# EAGLE design SpinCoaterV3-AU DC_Motor (EAGLE 7.4.0)
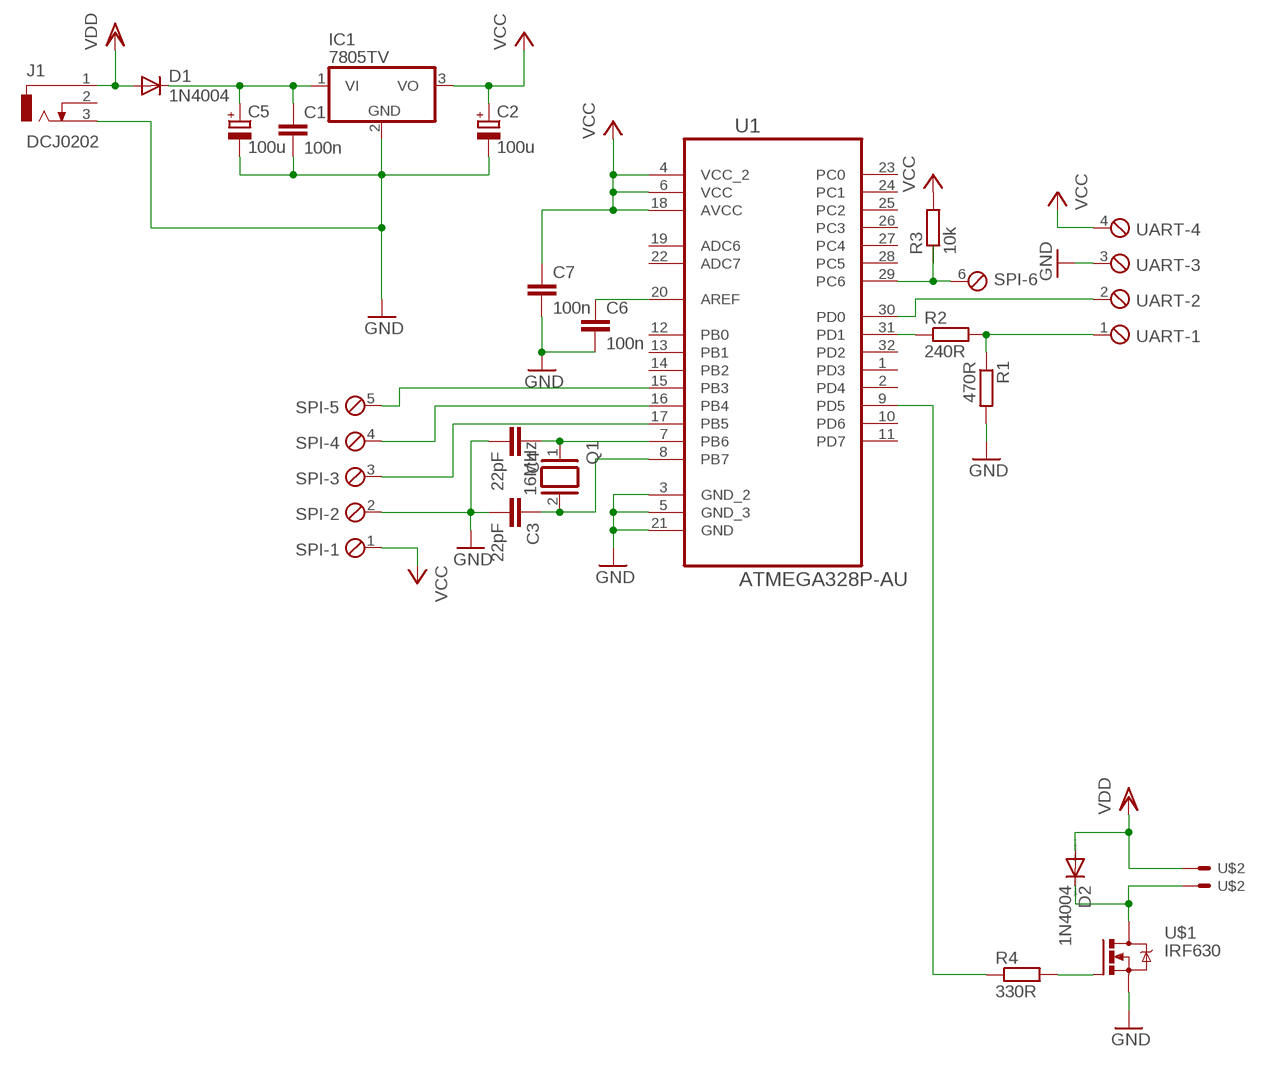
[diagram p0: schematic, sheet 1]

## Parts
C1  100n  C-EU075-032X103  [C075-032X103]
C2  100u  CPOL-EUE2.5-6  [E2,5-6]
C3  22pF  C-EU050-030X075  [C050-030X075]
C4  22pF  C-EU050-030X075  [C050-030X075]
C5  100u  CPOL-EUE2.5-6  [E2,5-6]
C6  100n  C-EU075-032X103  [C075-032X103]
C7  100n  C-EU075-032X103  [C075-032X103]
D1  1N4004  [DO41-10]
D2  1N4004  [DO41-10]
IC1  7805TV  [TO220V]
J1  DCJ0202  [DCJ0202]
Q1  16MHz  XTAL/S  [QS]
R1  470R  R-EU_0207/10  [0207/10]
R2  240R  R-EU_0207/10  [0207/10]
R3  10k  R-EU_0207/10  [0207/10]
R4  330R  R-EU_0207/10  [0207/10]
SPI  MPT6  [6POL254]
U1  ATMEGA328P-AU  [QFP80P900X900X120-32N]
U$1  IRF630  [TO-220BH]
U$2  CON-MOTORDC  [CON-MOTOR]
UART  MPT4  [4POL254]

## Nets
GND: C1.2 C2.- C3.2 C4.2 C5.- C6.2 C7.2 IC1.2(GND) J1.3 R1.2 SPI.2 U1.3(GND_2) U1.5(GND_3) U1.21(GND) U$1.S UART.3
N$1: R3.1 SPI.6 U1.29(PC6)
N$2: C4.1 Q1.1 U1.7(PB6)
N$3: C3.1 Q1.2 U1.8(PB7)
N$4: SPI.3 U1.17(PB5)
N$5: R2.1 U1.31(PD1)
N$6: SPI.4 U1.16(PB4)
N$7: SPI.5 U1.15(PB3)
N$8: R4.2 U$1.G
N$9: U1.30(PD0) UART.2
N$10: R1.1 R2.2 UART.1
N$11: R4.1 U1.9(PD5)
N$12: D2.C U$1.D U$2.P$2(S2)
N$13: C6.1 U1.20(AREF)
N$14: C1.1 C5.+ D1.C IC1.1(VI)
VCC: C2.+ C7.1 IC1.3(VO) R3.2 SPI.1 U1.4(VCC_2) U1.6(VCC) U1.18(AVCC) UART.4
VDD: D1.A D2.A J1.1 U$2.P$1(S1)
Unconnected: J1.2 U1.1(PD3) U1.2(PD4) U1.10(PD6) U1.11(PD7) U1.12(PB0) U1.13(PB1) U1.14(PB2) U1.19(ADC6) U1.22(ADC7) U1.23(PC0) U1.24(PC1) U1.25(PC2) U1.26(PC3) U1.27(PC4) U1.28(PC5) U1.32(PD2)

## Library data of the parts
C1 C3 C4 C6 C7 = rcl:C-EU: CAPACITOR, European symbol
C2 C5 = rcl:CPOL-EU: POLARIZED CAPACITOR, European symbol
D1 = diode-1:1N4004: DIODE general purpose rectifier, 1 A
D2 = diode:1N4004: DIODE general purpose rectifier, 1 A
IC1 = linear:78*: Positive VOLTAGE REGULATOR Source: http://cache.national.com/ds/LM/LM78L05.pdf http://www.fairchildsemi.com/ds/LM/LM7805.pdf
J1 = con-jack:DCJ0202: DC POWER JACK Source: DCJ0202.pdf; OC_FARNELL: unknown; OC_NEWARK: unknown
Q1 = special:XTAL/S: CRYSTAL
R1-R4 = rcl:R-EU_: RESISTOR, European symbol
SPI = con-phoenix-254:MPT6: PHOENIX CONNECTOR; OC_FARNELL: unknown; OC_NEWARK: unknown
U1 = Atmel_By_element14_Batch_1-00:ATMEGA328P-AU: 8-bit Microcontroller with In-System Programmable Flash; MPN: ATMEGA328P-AU; OC_FARNELL: 1715486; OC_NEWARK: 14R4631; PACKAGE: TQFP-32; SUPPLIER: Atmel
U$1 = OpenSpinCoaterComponent:IRF630
U$2 = OpenSpinCoaterComponent:CON-MOTORDC
UART = con-phoenix-254:MPT4: PHOENIX CONNECTOR; OC_FARNELL: unknown; OC_NEWARK: unknown

## Board
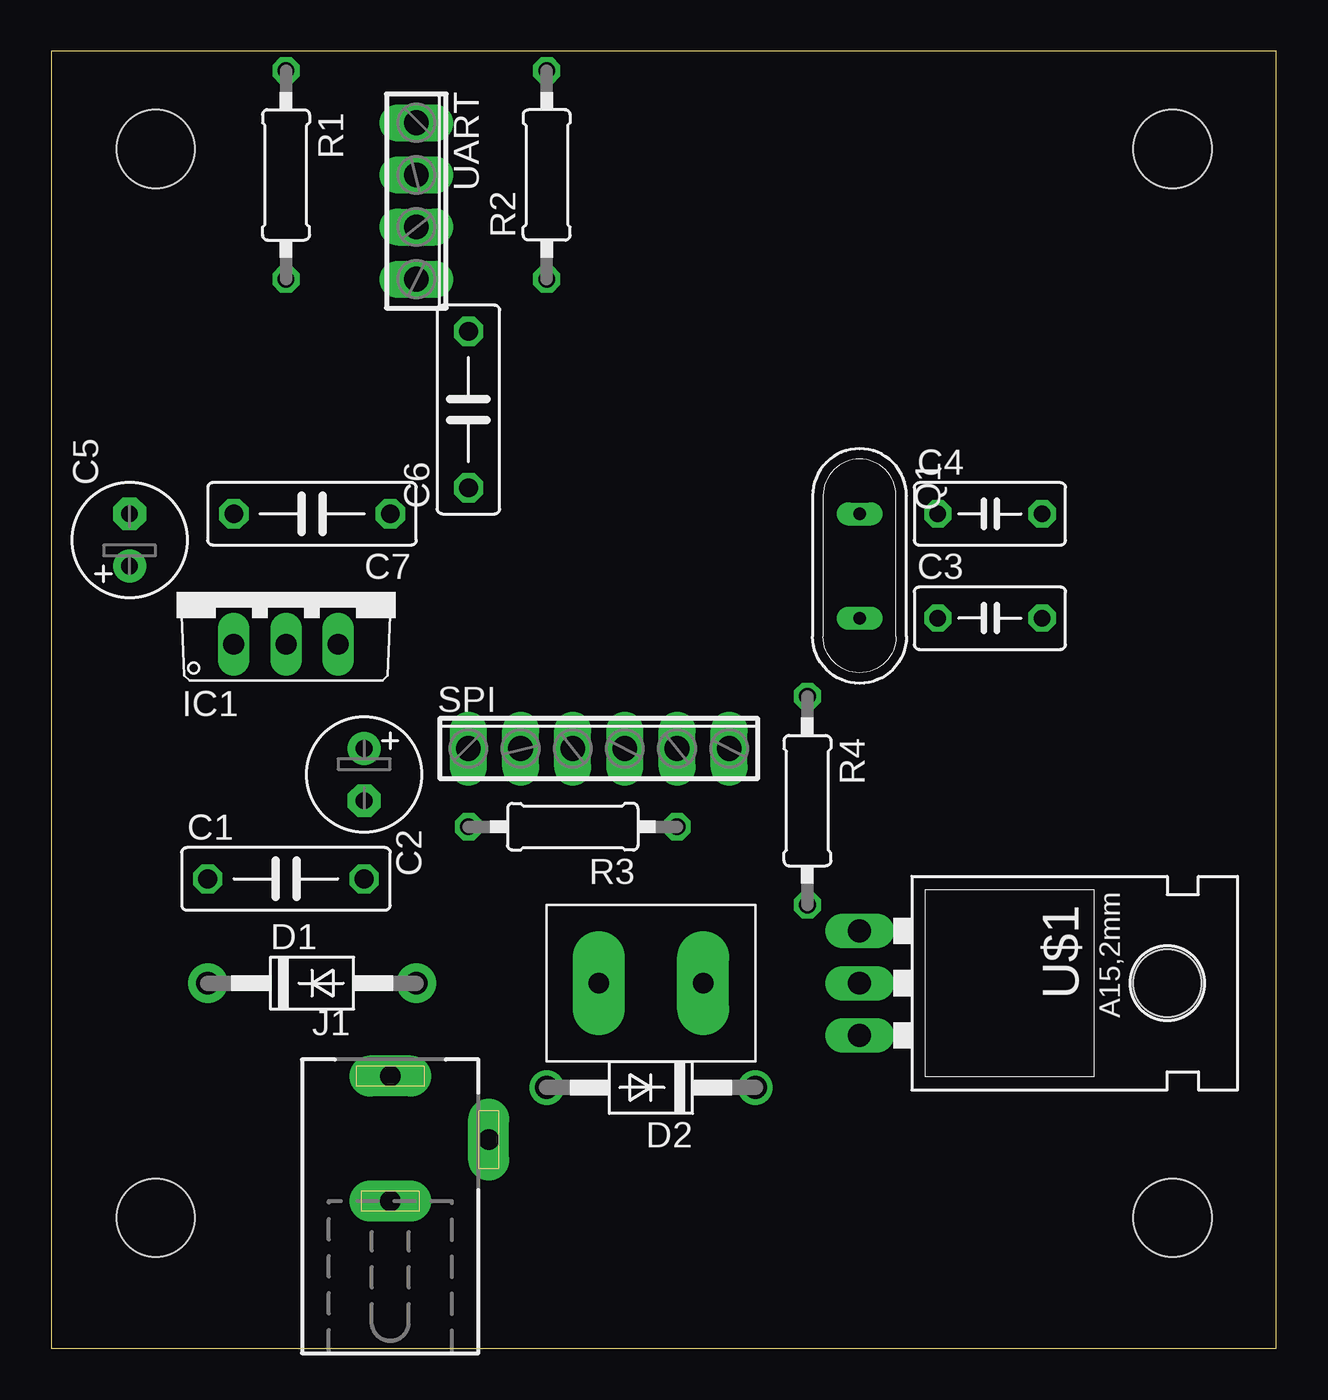
[diagram p1: board, top side]
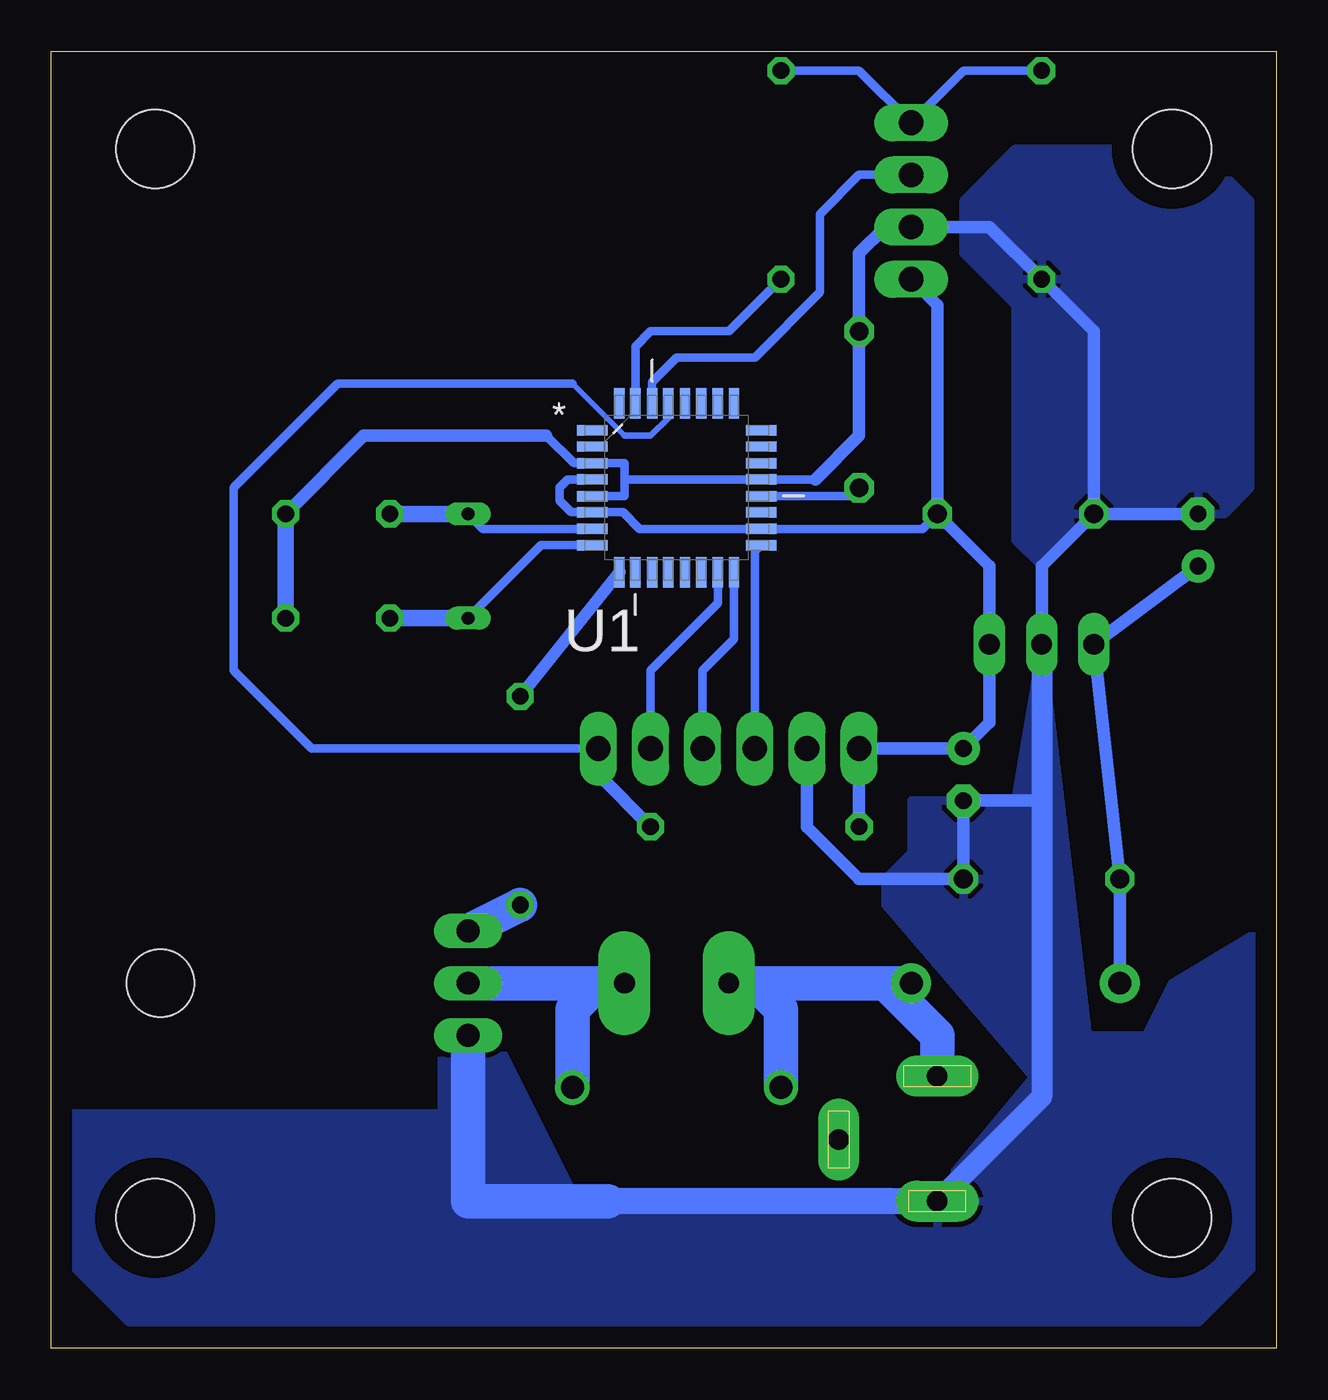
[diagram p2: board, bottom side, seen from below]

Size 59.67 x 63.17 mm. Coordinates in mm from the lower left corner, seen from the top.
Outline: 0,0 59.67,0 59.67,63.17 0,63.17 0,0
Copper layers (1*16): Top 0.035mm / dielectric 1.5mm / Bottom 0.035mm
Design rules "default": minimum track width 10mil, minimum drill 24mil, track to track 8mil, track to pad 8mil, pad to pad 8mil, via to via 8mil, smd to smd 8mil, copper to edge 40mil, drill to drill 8mil, minimum pad ring 10mil, minimum via ring 8mil, stop-mask expansion 4mil, vias tented up to drill 0mil, thermal gap 10mil
Holes 3.81 mm at 54.61,58.42 5.08,6.35 54.61,6.35 5.08,58.42

### Footprints (pad centres in the part's own frame; a part is rotated, then mirrored left to right if it is on the bottom)
C075-032X103 = drill 0.914 octagon: 1 -3.81,0; 2 3.81,0
E2,5-6 = drill 0.813 pad 1.6: + -1.27,0 | drill 0.813 pad 1.6 octagon: - 1.27,0
C050-030X075 = drill 0.813 octagon: 1 -2.54,0; 2 2.54,0
DO41-10 = drill 1.118 pad 1.93: A 5.08,0; C -5.08,0
DO41-10' = drill 1.118: A 5.08,0; C -5.08,0
TO220V = drill 1.016 long: 1 -2.54,-2.54; 2 0,-2.54; 3 2.54,-2.54
DCJ0202 = drill 1 pad 2 long: 1 0,3.1; 2 4.8,0; 3 0,-3
QS = drill 0.61 long: 1 -2.54,0; 2 2.54,0
0207/10 = drill 0.813 octagon: 1 -5.08,0; 2 5.08,0
6POL254 = drill 1.2 pad 1.778 long: 1 -6.35,0; 2 -3.81,0; 3 -1.27,0; 4 1.27,0; 5 3.81,0; 6 6.35,0
QFP80P900X900X120-32N = smd 1.473 x 0.508: 1 -4.115,2.794; 2 -4.115,2.007; 3 -4.115,1.194; 4 -4.115,0.406; 5 -4.115,-0.406; 6 -4.115,-1.194; 7 -4.115,-2.007; 8 -4.115,-2.794; 17 4.115,-2.794; 18 4.115,-2.007; 19 4.115,-1.194; 20 4.115,-0.406; 21 4.115,0.406; 22 4.115,1.194; 23 4.115,2.007; 24 4.115,2.794 | smd 0.508 x 1.473: 9 -2.794,-4.115; 10 -2.007,-4.115; 11 -1.194,-4.115; 12 -0.406,-4.115; 13 0.406,-4.115; 14 1.194,-4.115; 15 2.007,-4.115; 16 2.794,-4.115; 25 2.794,4.115; 26 2.007,4.115; 27 1.194,4.115; 28 0.406,4.115; 29 -0.406,4.115; 30 -1.194,4.115; 31 -2.007,4.115; 32 -2.794,4.115
TO-220BH = drill 1.118 long: D 0,-8.89; G -2.54,-8.89; S 2.54,-8.89 | hole 3.302: 0,6.096
CON-MOTOR = drill 1 pad 2.54 long: P$1 0,2.54; P$2 0,-2.54
4POL254 = drill 1.2 long: 1 -3.81,0; 2 -1.27,0; 3 1.27,0; 4 3.81,0

### Placement (x,y rotation side)
C1  11.43,22.86 0 top
C2  15.24,27.94 270 top
C3  45.72,35.56 0 top
C4  45.72,40.64 0 top
C5  3.81,39.37 90 top
C6  20.32,45.72 90 top
C7  12.7,40.64 180 top
D1  12.7,17.78 0 top
D2  1N4004  [DO41-10']  29.21,12.7 180 top
IC1  11.43,36.83 0 top
J1  16.51,10.16 0 top
Q1  39.37,38.1 270 top
R1  11.43,57.15 270 top
R2  24.13,57.15 90 top
R3  25.4,25.4 180 top
R4  36.83,26.67 270 top
SPI  26.67,29.21 0 top
U1  29.21,41.91 0 bottom
U$1  48.26,17.78 270 top
U$2  29.21,17.78 90 top
UART  17.78,55.88 270 top

### Tracks (layer width: path | path; a pad name or v marks a point on that pad's centre or on a via)
GND
  Bottom 0.406: 31.75,42.32 31.75,43.1 U1.3 34.21,43.1 35.56,44.45 | U1.5 31.75,41.5 31.75,42.32 | UART.3 19.05,54.61 | 22.45,42.32 U1.21 31.75,42.32
  Bottom 0.61: 35.56,44.45 44.45,44.45 C4.2 | C7.2 8.89,49.53 R1.2 13.97,54.61 UART.3 | 22.45,42.32 20.32,44.45 C6.2 20.32,53.34 19.05,54.61 | C7.2 11.43,38.1 IC1.2 | SPI.2 22.86,25.4 20.32,22.86 C1.2 C2.- 11.43,26.67 | C5.- C7.2
  Bottom 0.813: C4.2 C3.2
  Bottom 1.016: IC1.2 11.43,26.67 11.43,12.24 J1.3
  Bottom 1.27: U$1.S 39.37,7.62 | J1.3 32.56,7.16
  Bottom 1.676: 32.56,7.16 39.37,7.16 U$1.S
  pour Bottom: 8.89,40.64 2.54,40.64 1.27,41.91 1.27,55.88 3.81,58.42 12.7,58.42 15.24,55.88 15.24,53.34 12.7,50.8 12.7,39.37 11.43,38.1
  pour Bottom: 16.51,7.62 10.16,15.24 6.35,15.24 5.08,17.78 -1.27,21.59 0,5.08 3.81,1.27 55.88,1.27 59.69,5.08 59.69,11.43 40.64,11.43 40.64,15.24 38.1,15.24 34.29,7.62
  pour Bottom: 12.7,26.67 17.78,26.67 17.78,24.13 19.05,22.86 19.05,21.59 11.43,12.7 8.89,12.7 11.43,34.29
N$1
  Bottom 0.254: 31.75,44.45 34.29,46.99
  Bottom 0.305: 31.75,44.45 30.48,44.45 29.62,45.31 U1.29
  Bottom 0.406: SPI.6 46.99,29.21 50.8,33.02 50.8,41.91 45.72,46.99 34.29,46.99
  Bottom 0.61: SPI.6 33.02,27.94 R3.1
N$2
  Bottom 0.406: Q1.1 38.63,39.9 U1.7
  Bottom 0.813: C4.1 Q1.1
N$3
  Bottom 0.406: Q1.2 35.81,39.12 U1.8
  Bottom 0.813: C3.1 Q1.2
N$4
  Bottom 0.406: U1.17 25.4,38.81 SPI.3
N$5
  Bottom 0.406: R2.1 26.67,49.53 30.48,49.53 31.22,48.79 U1.31
N$6
  Bottom 0.406: U1.16 26.42,34.54 27.94,33.02 SPI.4
N$7
  Bottom 0.406: U1.15 27.2,36.3 30.48,33.02 SPI.5
N$8
  Bottom 1.676: R4.2 U$1.G
N$9
  Bottom 0.406: UART.2 20.32,57.15 22.23,55.24 22.23,51.44 25.4,48.26 29.21,48.26 30.4,47.07 U1.30
N$10
  Bottom 0.406: R2.2 20.32,62.23 UART.1 15.24,62.23 R1.1
N$11
  Bottom 0.61: U1.9 R4.1
N$12
  Bottom 1.676: U$1.D 33.02,17.78 | 33.02,17.78 U$2.P$2 | D2.C 34.29,16.51 33.02,17.78
N$13
  Bottom 0.406: C6.1 20.73,41.5 U1.20
N$14
  Bottom 0.61: C5.+ IC1.1 C1.1 D1.C
VCC
  Bottom 0.406: C7.1 17.25,39.9 U1.18 31.01,39.9 31.83,40.72 U1.6 34.37,40.72 34.92,41.27 34.92,41.91 34.52,42.32 U1.4
  Bottom 0.61: R3.2 SPI.1 C2.+ 13.97,30.48 IC1.3 13.97,38.1 C7.1 16.51,50.8 UART.4
VDD
  Bottom 1.676: D1.A 19.05,17.78 | 19.05,17.78 25.4,17.78 | 25.4,17.78 U$2.P$1 | J1.1 16.51,15.24 19.05,17.78 | D2.A 24.13,16.51 25.4,17.78

### Text on the board
tTest: BRX | BTX | GND | +5V | VCC | GND | SCK | MISO | MOSI | /RESET